# EAGLE schematic schematic (EAGLE 9.6.2)

## Sheet 1 of 3
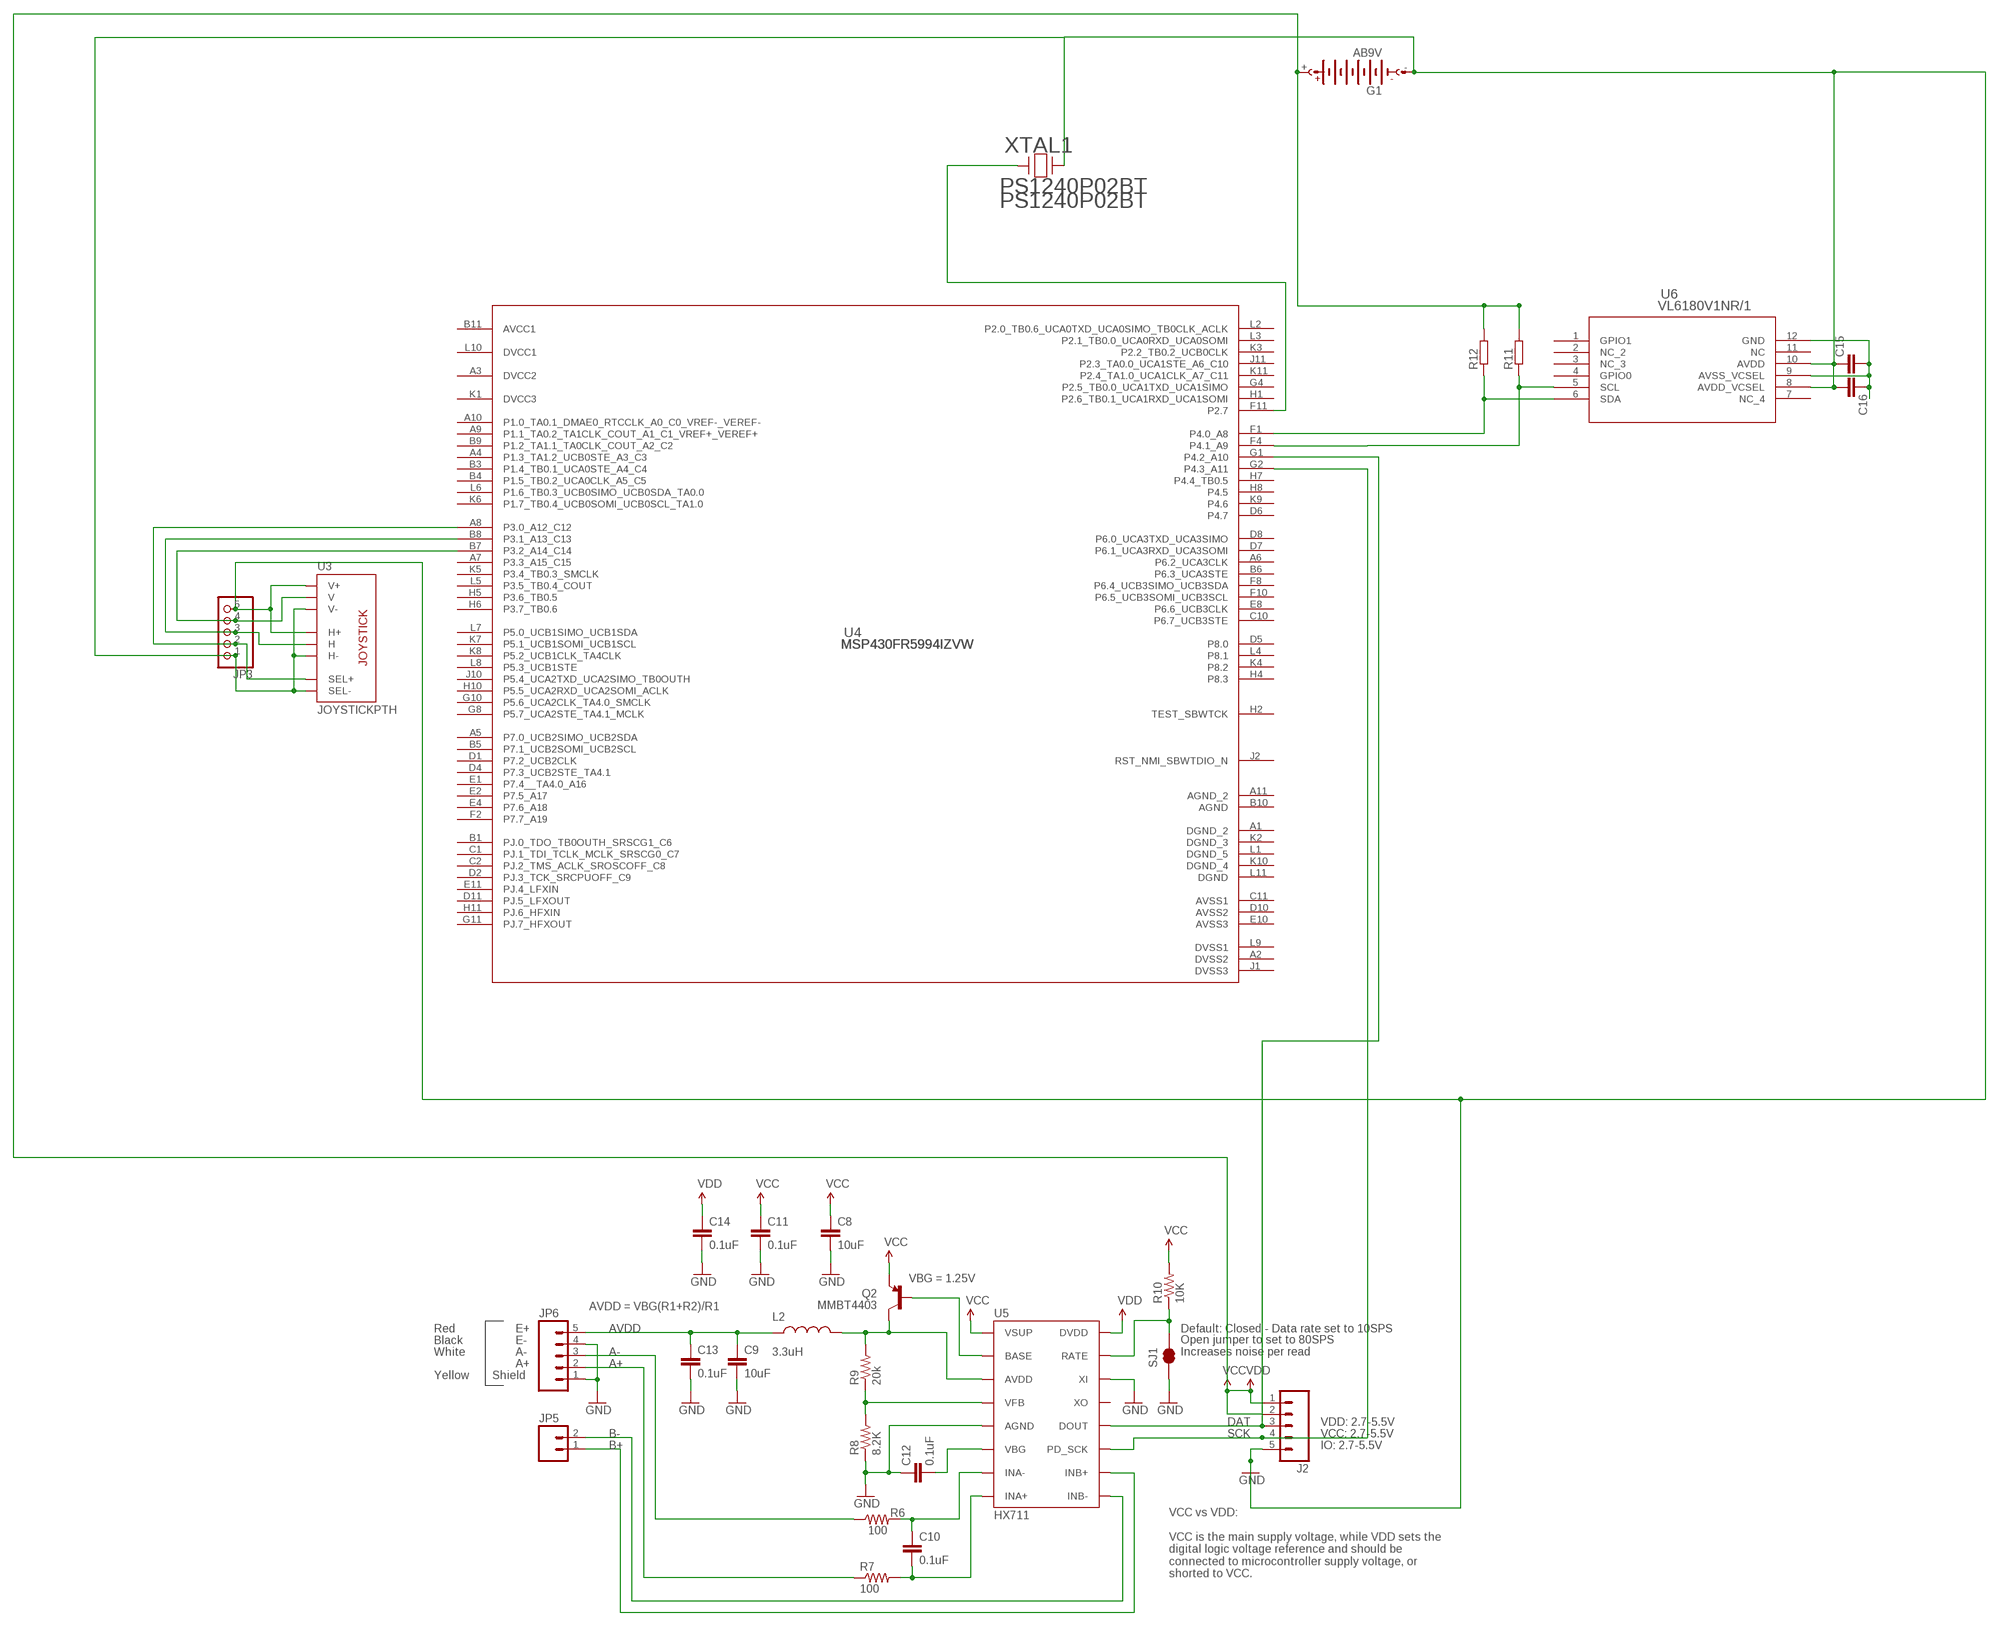
[diagram p0: schematic, sheet 1]

### Parts
C8  10uF  10UF50V20%(1210)  [1210]
C9  10uF  10UF50V20%(1210)  [1210]
C10  0.1uF  0.1UF-25V-5%(0603)  [0603-CAP]
C11  0.1uF  0.1UF-25V-5%(0603)  [0603-CAP]
C12  0.1uF  0.1UF-25V-5%(0603)  [0603-CAP]
C13  0.1uF  0.1UF-25V-5%(0603)  [0603-CAP]
C14  0.1uF  0.1UF-25V-5%(0603)  [0603-CAP]
C15  C2.5/2  [C2.5-2]
C16  C2.5/2  [C2.5-2]
G1  AB9V  [AB9V]
J2  M05PTH  [1X05]
JP3  PINHD-1X5  [1X05]
JP5  M02PTH  [1X02]
JP6  M05PTH  [1X05]
L2  3.3uH  INDUCTOR0805-IND  [0805]
Q2  MMBT4403  TRANSISTOR_PNPMMBT4403  [SOT23-3]
R6  100  100OHM-1/10W-1%(0603)  [0603-RES]
R7  100  100OHM-1/10W-1%(0603)  [0603-RES]
R8  8.2K  8.2KOHM-1/10W-5%(0603)  [0603-RES]
R9  20k  20KOHM1/10W1%(0603)  [0603-RES]
R10  10K  10KOHM-1/10W-1%(0603)0603  [0603-RES]
R11  PMD  [PMD]
R12  PMD  [PMD]
SJ1  JUMPER-PAD-2-NC_BY_TRACE  [PAD-JUMPER-2-NC_BY_TRACE_YES_SILK]
U3  JOYSTICKPTH  [JOYSTICK]
U4  MSP430FR5994IZVW  [ZVW0087A]
U5  HX711  HX711HX711  [SO16]
U6  VL6180V1NR/1  [VL6180X_STM]
XTAL1  PS1240P02BT  [XTAL_PS1240P02BT_TDK]

### Nets
A+: JP6.2 R7.1 ; also sheet 3
A-: JP6.3 R6.1 ; also sheet 3
AVDD: C9.1 C13.1 JP6.5 L2.1 ; also sheet 3
B+: JP5.1 U5.10(INB+) ; also sheet 3
B-: JP5.2 U5.9(INB-) ; also sheet 3
DAT: J2.3 U4.G1(P4.2_A10) U5.12(DOUT) ; also sheet 3
GND: C8.2 C9.2 C11.2 C12.1 C13.2 C14.2 C15.1 C16.2 G1.- J2.5 JP3.1 JP3.5 JP6.1 JP6.4 R8.1 SJ1.1 U3.B2A(SEL-) U3.H1(H+) U3.H3(H-) U3.V1(V+) U3.V3(V-) U5.5(AGND) U5.14(XI) U6.8(AVDD_VCSEL) U6.10(AVDD) XTAL1.2 ; also sheet 3
N$14: Q2.1(B) U5.2(BASE)
N$15: JP3.4 U3.V2(V) U4.B7(P3.2_A14_C14)
N$16: JP3.3 U3.H2(H) U4.B8(P3.1_A13_C13)
N$17: JP3.2 U3.B1A(SEL+) U4.A8(P3.0_A12_C12)
N$18: U4.F11(P2.7) XTAL1.1
N$19: R8.2 R9.1 U5.4(VFB)
N$20: C12.2 U5.6(VBG)
N$21: L2.2 Q2.3(C) R9.2 U5.3(AVDD)
N$22: R10.1 SJ1.2 U5.15(RATE)
N$23: C10.1 R6.2 U5.7(INA-)
N$24: C10.2 R7.2 U5.8(INA+)
N$25: C15.2 C16.1 U6.9(AVSS_VCSEL) U6.12(GND)
N$27: R11.2 U4.F4(P4.1_A9) U6.5(SCL)
N$28: R12.2 U4.F1(P4.0_A8) U6.6(SDA)
SCK: J2.4 U4.G2(P4.3_A11) U5.11(PD_SCK) ; also sheet 3
VCC: C8.1 C11.1 Q2.2(E) R10.2 U5.1(VSUP) ; also sheet 3
VDD: C14.1 G1.+ J2.1 J2.2 R11.1 R12.1 U5.16(DVDD) ; supply symbol labelled VCC ; also sheet 3
Unconnected: U4.A4(P1.3_TA1.2_UCB0STE_A3_C3) U4.A5(P7.0_UCB2SIMO_UCB2SDA) U4.A6(P6.2_UCA3CLK) U4.A7(P3.3_A15_C15) U4.A9(P1.1_TA0.2_TA1CLK_COUT_A1_C1_VREF+_VEREF+) U4.A10(P1.0_TA0.1_DMAE0_RTCCLK_A0_C0_VREF-_VEREF-) U4.B1(PJ.0_TDO_TB0OUTH_SRSCG1_C6) U4.B3(P1.4_TB0.1_UCA0STE_A4_C4) U4.B4(P1.5_TB0.2_UCA0CLK_A5_C5) U4.B5(P7.1_UCB2SOMI_UCB2SCL) U4.B6(P6.3_UCA3STE) U4.B9(P1.2_TA1.1_TA0CLK_COUT_A2_C2) U4.C1(PJ.1_TDI_TCLK_MCLK_SRSCG0_C7) U4.C2(PJ.2_TMS_ACLK_SROSCOFF_C8) U4.C10(P6.7_UCB3STE) U4.D1(P7.2_UCB2CLK) U4.D2(PJ.3_TCK_SRCPUOFF_C9) U4.D4(P7.3_UCB2STE_TA4.1) U4.D5(P8.0) U4.D6(P4.7) U4.D7(P6.1_UCA3RXD_UCA3SOMI) U4.D8(P6.0_UCA3TXD_UCA3SIMO) U4.D11(PJ.5_LFXOUT) U4.E1(P7.4__TA4.0_A16) U4.E2(P7.5_A17) U4.E4(P7.6_A18) U4.E8(P6.6_UCB3CLK) U4.E11(PJ.4_LFXIN) U4.F2(P7.7_A19) U4.F8(P6.4_UCB3SIMO_UCB3SDA) U4.F10(P6.5_UCB3SOMI_UCB3SCL) U4.G4(P2.5_TB0.0_UCA1TXD_UCA1SIMO) U4.G8(P5.7_UCA2STE_TA4.1_MCLK) U4.G10(P5.6_UCA2CLK_TA4.0_SMCLK) U4.G11(PJ.7_HFXOUT) U4.H1(P2.6_TB0.1_UCA1RXD_UCA1SOMI) U4.H2(TEST_SBWTCK) U4.H4(P8.3) U4.H5(P3.6_TB0.5) U4.H6(P3.7_TB0.6) U4.H7(P4.4_TB0.5) U4.H8(P4.5) U4.H10(P5.5_UCA2RXD_UCA2SOMI_ACLK) U4.H11(PJ.6_HFXIN) U4.J2(RST_NMI_SBWTDIO_N) U4.J10(P5.4_UCA2TXD_UCA2SIMO_TB0OUTH) U4.J11(P2.3_TA0.0_UCA1STE_A6_C10) U4.K3(P2.2_TB0.2_UCB0CLK) U4.K4(P8.2) U4.K5(P3.4_TB0.3_SMCLK) U4.K6(P1.7_TB0.4_UCB0SOMI_UCB0SCL_TA1.0) U4.K7(P5.1_UCB1SOMI_UCB1SCL) U4.K8(P5.2_UCB1CLK_TA4CLK) U4.K9(P4.6) U4.K11(P2.4_TA1.0_UCA1CLK_A7_C11) U4.L2(P2.0_TB0.6_UCA0TXD_UCA0SIMO_TB0CLK_ACLK) U4.L3(P2.1_TB0.0_UCA0RXD_UCA0SOMI) U4.L4(P8.1) U4.L5(P3.5_TB0.4_COUT) U4.L6(P1.6_TB0.3_UCB0SIMO_UCB0SDA_TA0.0) U4.L7(P5.0_UCB1SIMO_UCB1SDA) U4.L8(P5.3_UCB1STE) U5.13(XO) U6.1(GPIO1) U6.2(NC_2) U6.3(NC_3) U6.4(GPIO0) U6.7(NC_4) U6.11(NC)

### Notes on the sheet
- VBG = 1.25V
- AVDD = VBG(R1+R2)/R1
- Red | E+ | Default: Closed - Data rate set to 10SPS
- Black | E-
- White | A-
- Open jumper to set to 80SPS
  Increases noise per read
- A+
- Yellow | Shield
- VDD: 2.7-5.5V
- VCC: 2.7-5.5V
- IO: 2.7-5.5V
- VCC vs VDD:
  
  VCC is the main supply voltage, while VDD sets the
  digital logic voltage reference and should be
  connected to microcontroller supply voltage, or
  shorted to VCC.

## Sheet 2 of 3
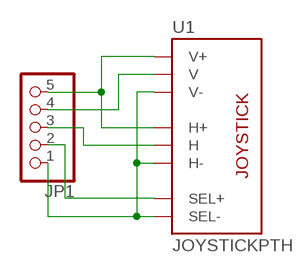
[diagram p1: schematic, sheet 2]

### Parts
JP1  PINHD-1X5  [1X05]
U1  JOYSTICKPTH  [JOYSTICK]

### Nets
N$1: JP1.5 U1.H1(H+) U1.V1(V+)
N$2: JP1.1 U1.B2A(SEL-) U1.H3(H-) U1.V3(V-)
N$3: JP1.4 U1.V2(V)
N$4: JP1.3 U1.H2(H)
N$5: JP1.2 U1.B1A(SEL+)

## Sheet 3 of 3
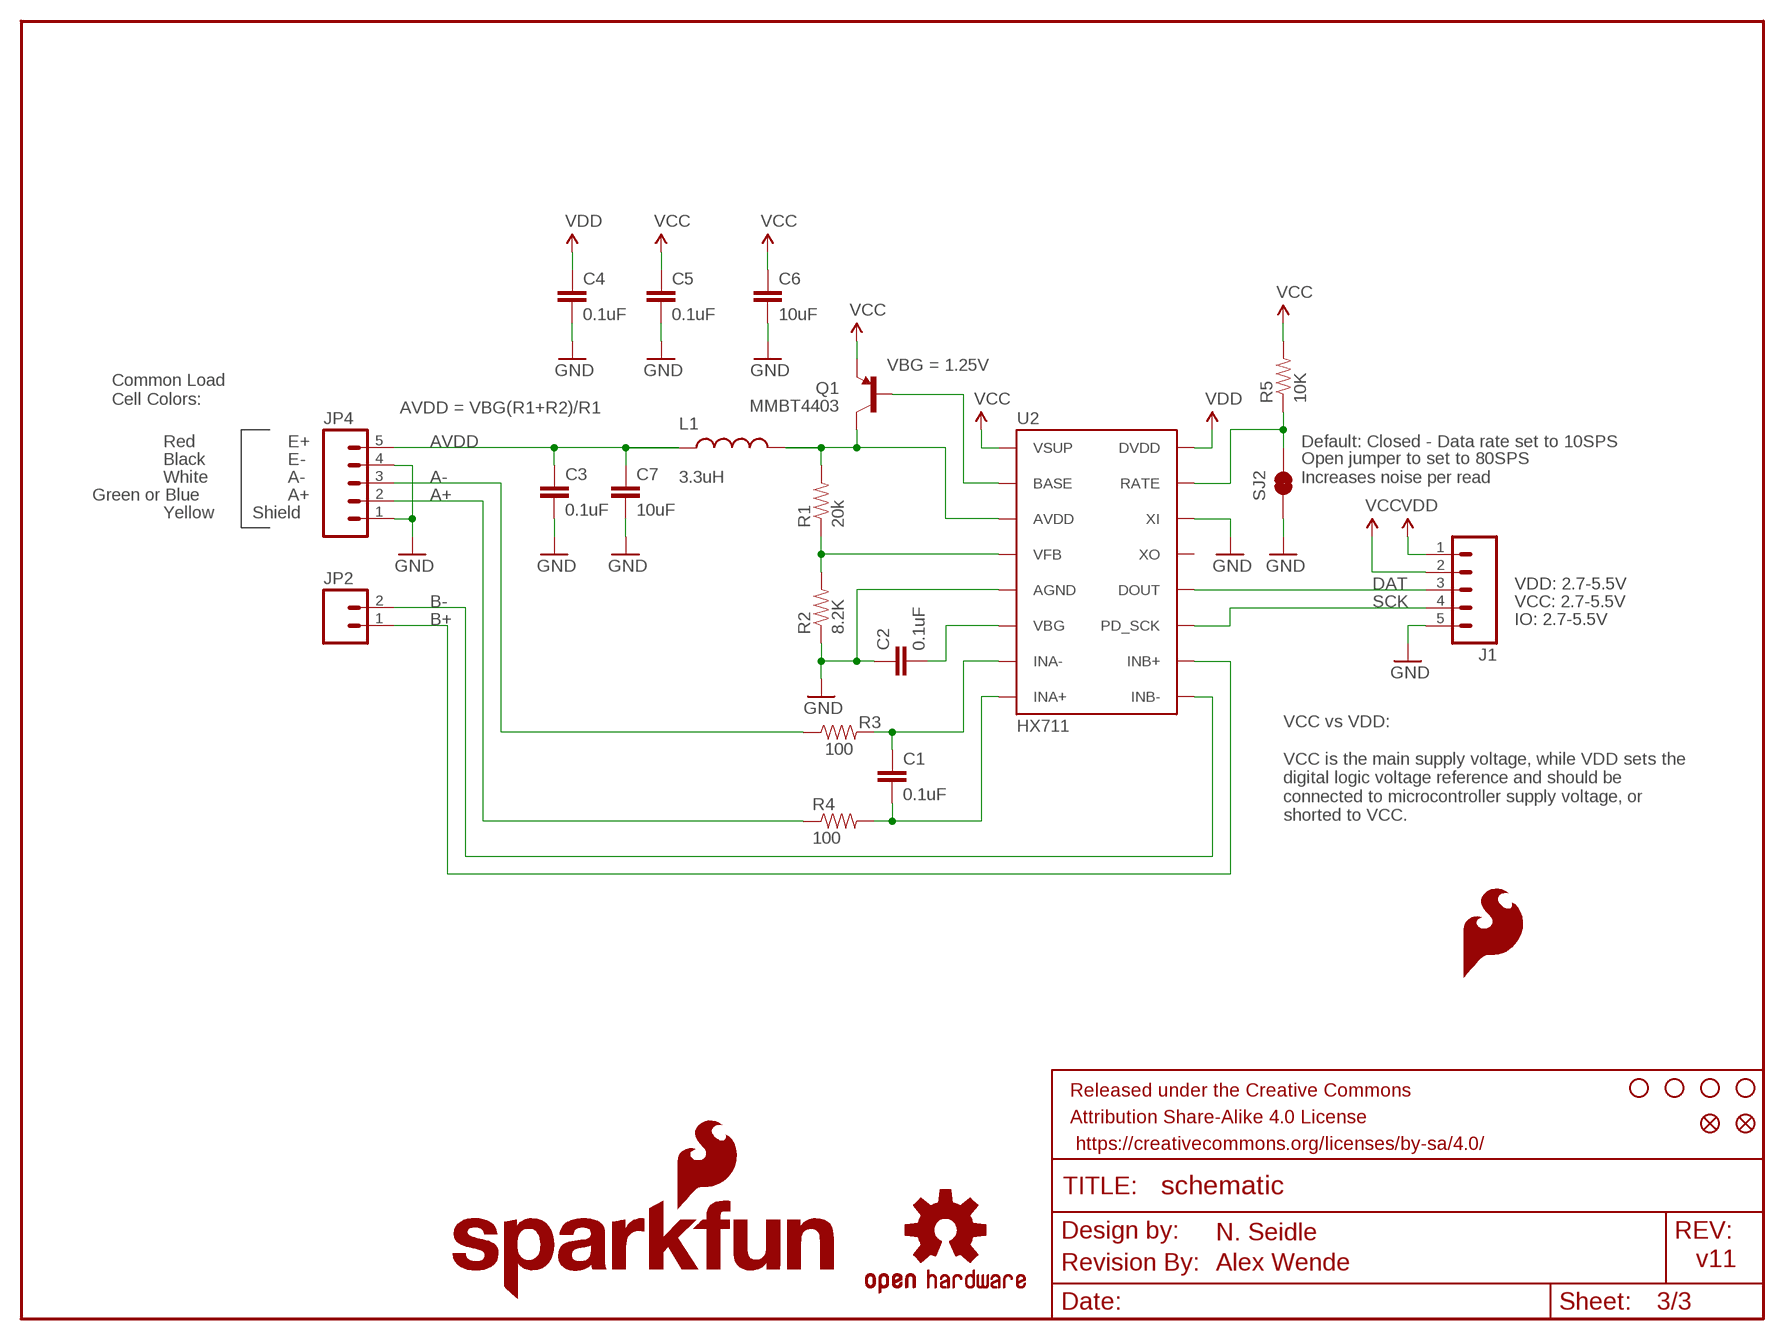
[diagram p2: schematic, sheet 3]

### Parts
C1  0.1uF  0.1UF-25V-5%(0603)  [0603-CAP]
C2  0.1uF  0.1UF-25V-5%(0603)  [0603-CAP]
C3  0.1uF  0.1UF-25V-5%(0603)  [0603-CAP]
C4  0.1uF  0.1UF-25V-5%(0603)  [0603-CAP]
C5  0.1uF  0.1UF-25V-5%(0603)  [0603-CAP]
C6  10uF  10UF50V20%(1210)  [1210]
C7  10uF  10UF50V20%(1210)  [1210]
FID1  FIDUCIAL1X2  [FIDUCIAL-1X2]
FID2  FIDUCIAL1X2  [FIDUCIAL-1X2]
FRAME1  FRAME-LETTER  [CREATIVE_COMMONS]
J1  M05PTH  [1X05]
JP2  M02PTH  [1X02]
JP4  M05PTH  [1X05]
L1  3.3uH  INDUCTOR0805-IND  [0805]
LOGO1  SFE_LOGO_NAME_FLAME.1_INCH  [SFE_LOGO_NAME_FLAME_.1]
LOGO3  SFE_LOGO_FLAME.1_INCH  [SFE_LOGO_FLAME_.1]
Q1  MMBT4403  TRANSISTOR_PNPMMBT4403  [SOT23-3]
R1  20k  20KOHM1/10W1%(0603)  [0603-RES]
R2  8.2K  8.2KOHM-1/10W-5%(0603)  [0603-RES]
R3  100  100OHM-1/10W-1%(0603)  [0603-RES]
R4  100  100OHM-1/10W-1%(0603)  [0603-RES]
R5  10K  10KOHM-1/10W-1%(0603)0603  [0603-RES]
SJ2  JUMPER-PAD-2-NC_BY_TRACE  [PAD-JUMPER-2-NC_BY_TRACE_YES_SILK]
STANDOFF1  STAND-OFF  [STAND-OFF]
STANDOFF2  STAND-OFF  [STAND-OFF]
STANDOFF3  STAND-OFF  [STAND-OFF]
STANDOFF4  STAND-OFF  [STAND-OFF]
U2  HX711  HX711HX711  [SO16]
U7  OSHW-LOGOS  [OSHW-LOGO-S]
U$1  REVISION  [REVISION]

### Nets
A+: JP4.2 R4.1 ; also sheet 1
A-: JP4.3 R3.1 ; also sheet 1
AVDD: C3.1 C7.1 JP4.5 L1.1 ; also sheet 1
B+: JP2.1 U2.10(INB+) ; also sheet 1
B-: JP2.2 U2.9(INB-) ; also sheet 1
DAT: J1.3 U2.12(DOUT) ; also sheet 1
GND: C2.1 C3.2 C4.2 C5.2 C6.2 C7.2 J1.5 JP4.1 JP4.4 R2.1 SJ2.1 U2.5(AGND) U2.14(XI) ; also sheet 1
N$6: Q1.1(B) U2.2(BASE)
N$7: R1.1 R2.2 U2.4(VFB)
N$8: C2.2 U2.6(VBG)
N$9: L1.2 Q1.3(C) R1.2 U2.3(AVDD)
N$10: R5.1 SJ2.2 U2.15(RATE)
N$11: C1.1 R3.2 U2.7(INA-)
N$12: C1.2 R4.2 U2.8(INA+)
SCK: J1.4 U2.11(PD_SCK) ; also sheet 1
VCC: C5.1 C6.1 J1.2 Q1.2(E) R5.2 U2.1(VSUP) ; also sheet 1
VDD: C4.1 J1.1 U2.16(DVDD) ; also sheet 1
Unconnected: U2.13(XO)

### Notes on the sheet
- VBG = 1.25V
- Common Load
  Cell Colors:
- AVDD = VBG(R1+R2)/R1
- Red | E+ | Default: Closed - Data rate set to 10SPS
- Black | E-
- White | A-
- Open jumper to set to 80SPS
  Increases noise per read
- Green or Blue | A+
- Yellow | Shield
- VDD: 2.7-5.5V
- VCC: 2.7-5.5V
- IO: 2.7-5.5V
- VCC vs VDD:
  
  VCC is the main supply voltage, while VDD sets the
  digital logic voltage reference and should be
  connected to microcontroller supply voltage, or
  shorted to VCC.
- N. Seidle
- Alex Wende | v11

## Power pins joined to a net without a drawn wire
AGND: U4.B10(AGND)
AGND_2: U4.A11(AGND_2)
AVCC1: U4.B11(AVCC1)
AVSS1: U4.C11(AVSS1)
AVSS2: U4.D10(AVSS2)
AVSS3: U4.E10(AVSS3)
DGND: U4.L11(DGND)
DGND_2: U4.A1(DGND_2)
DGND_3: U4.K2(DGND_3)
DGND_4: U4.K10(DGND_4)
DGND_5: U4.L1(DGND_5)
DVCC1: U4.L10(DVCC1)
DVCC2: U4.A3(DVCC2)
DVCC3: U4.K1(DVCC3)
DVSS1: U4.L9(DVSS1)
DVSS2: U4.A2(DVSS2)
DVSS3: U4.J1(DVSS3)

## Library data of the parts
C1-C5 C10-C14 = SparkFun-Capacitors:0.1UF-25V-5%(0603): CAP-08604; PROD_ID: CAP-08604
C6-C9 = SparkFun-Capacitors:10UF50V20%(1210): CAP-09824; PROD_ID: CAP-09824
C15 C16 = capacitor-wima:C: CAPACITOR naming: grid - package width
FID1 FID2 = SparkFun-Aesthetics:FIDUCIAL: Fiducial Alignment Points Various fiducial points for machine vision alignment.
FRAME1 = SparkFun-Aesthetics:FRAME-LETTER: Schematic Frame Standard 8.5x11 US Letter frame
G1 = battery:AB9V: 9-V BATTERY CLIP
J1 J2 JP4 JP6 = SparkFun-Connectors:M05: Header 5 Standard 5-pin 0.1" header. Use with straight break away headers (SKU : PRT-00116), right angle break away headers (PRT-00553), swiss pins (PRT-00743), machine pins (PRT-00117), and female headers (PRT-00115). Molex polarized connector foot print use with SKU : PRT-08230 with associated crimp pins and housings.
JP1 JP3 = pinhead:PINHD-1X5: PIN HEADER
JP2 JP5 = SparkFun-Connectors:M02: Standard 2-pin 0.1" header. Use with - straight break away headers ( PRT-00116) - right angle break away headers (PRT-00553) - swiss pins (PRT-00743) - machine pins (PRT-00117) - female headers (PRT-00115) Molex polarized connector foot print use with: PRT-08233 with associated crimp pins and housings. 2.54_SCREWTERM for use with PRT-10571. 3.5mm Screw Terminal footprints for PRT-08084 5mm Screw Terminal footprints for use with PRT-08432
L1 L2 = SparkFun-Passives:INDUCTOR: Inductors Basic Inductor/Choke - 0603 and 1206. Footprints are not proven and vary greatly between part numbers. INDUCTOR POWER 3.3UH 4.0A SMD 0.197" L x 0.197" W x 0.177" H (5.00mm x 5.00mm x 4.50mm); PROD_ID: NDUC-13076
LOGO1 = SparkFun-Aesthetics:SFE_LOGO_NAME_FLAME: SFE Logo, name and flame This is the SparkFun full logo. The logo on the schematic will always be the same size; the package variant is the height of the flame part of the logo. Default layer for the logo on the board is tSilk.
LOGO3 = SparkFun-Aesthetics:SFE_LOGO_FLAME: SFE Logo, flame only This is the SparkFun flame logo. The logo on the schematic will always be the same size; the package variant is the height of the flame. Default layer for the logo on the board is tSilk.
Q1 Q2 = SparkFun-DiscreteSemi:TRANSISTOR_PNP: Generic PNP BJT Double check pinouts against datasheets- not all devices are the same! MMBT3906 - 40V 200mA SOT-23 (TRANS-08052) MMBT4403 - 40V 600mA SOT-23 (TRANS-09245); PROD_ID: TRANS-09245
R1 R9 = SparkFun-Resistors:20KOHM1/10W1%(0603): RES-09383; PROD_ID: RES-09383
R2 R8 = SparkFun-Resistors:8.2KOHM-1/10W-5%(0603): RES-10646; PROD_ID: RES-10646
R3 R4 R6 R7 = SparkFun-Resistors:100OHM-1/10W-1%(0603): RES-07863; PROD_ID: RES-07863
R5 R10 = SparkFun-Resistors:10KOHM-1/10W-1%(0603): RES-00824; PROD_ID: RES-00824
R11 R12 = resistor-shunt:PMD: SMD SHUNT RESISTOR; OC_FARNELL: unknown; OC_NEWARK: unknown
SJ1 SJ2 = SparkFun-Passives:JUMPER-PAD-2-NC_BY_TRACE
STANDOFF1-STANDOFF4 = SparkFun-Electromechanical:STAND-OFF: #4 Stand Off This is the mechanical footprint for a #4 phillips button head screw. Use the keepout ring to avoid running the screw head into surrounding components. SKU : PRT-00447
U1 U3 = adafruit:JOYSTICK: Thumb Joystick Joystick commonly found in PS2 controllers. Two pots and a select switch. Adapted from Sparkfun Library (but for more common 6mm switch sticks)
U2 U5 = Testing:HX711; PROD_ID: IC-12445
U4 = library:MSP430FR5994IZVW; COPYRIGHT: Copyright (C) 2025 Ultra Librarian. All rights reserved.; MANUFACTURER_PART_NUMBER: MSP430FR5994IZVW; MFR_NAME: Texas Instruments; REFDES: RefDes; TYPE: TYPE
U6 = library:VL6180V1NR/1; COPYRIGHT: Copyright (C) 2025 Ultra Librarian. All rights reserved.; MANUFACTURER_PART_NUMBER: VL6180V1NR/1; MFR_NAME: STMicroelectronics
U7 = SparkFun-Aesthetics:OSHW-LOGO: Open Source Hardware Logo This logo indicates the piece of hardware it is found on incorporates a OSHW license and/or adheres to the definition of open source hardware found here: http://freedomdefined.org/OSHW
U$1 = SparkFun-Aesthetics:REVISION
XTAL1 = library:PS1240P02BT; COPYRIGHT: Copyright (C) 2025 Ultra Librarian. All rights reserved.; MANUFACTURER_PART_NUMBER: PS1240P02BT; MFR_NAME: TDK